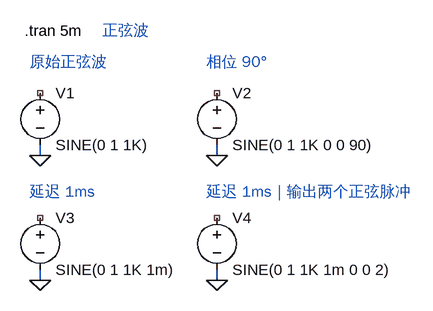
[diagram p0: schematic 03_SINWave.asc]
03_SINWave.asc, the LTspice schematic file:
Version 4
SHEET 1 880 680
WIRE 32 224 32 208
WIRE 304 224 304 208
WIRE 32 416 32 400
WIRE 304 416 304 400
FLAG 32 224 0
FLAG 304 224 0
FLAG 32 416 0
FLAG 304 416 0
SYMBOL Voltage 32 112 R0
SYMATTR InstName V1
SYMATTR Value SINE(0 1 1K)
SYMBOL Voltage 304 112 R0
SYMATTR InstName V2
SYMATTR Value SINE(0 1 1K 0 0 90)
SYMBOL Voltage 32 304 R0
SYMATTR InstName V3
SYMATTR Value SINE(0 1 1K 1m)
SYMBOL Voltage 304 304 R0
SYMATTR InstName V4
SYMATTR Value SINE(0 1 1K 1m 0 0 2)
TEXT 16 80 Left 2 ;原始正弦波
TEXT 8 32 Left 2 !.tran 5m
TEXT 288 80 Left 2 ;相位 90°
TEXT 16 280 Left 2 ;延迟 1ms
TEXT 288 280 Left 2 ;延迟 1ms｜输出两个正弦脉冲
TEXT 128 32 Left 2 ;正弦波

The netlist it stands for:
* 03_SINWave.asc
V1 NC_01 0 SINE(0 1 1K)
V2 NC_02 0 SINE(0 1 1K 0 0 90)
V3 NC_03 0 SINE(0 1 1K 1m)
V4 NC_04 0 SINE(0 1 1K 1m 0 0 2)
* 原始正弦波
.tran 5m
* 相位 90°
* 延迟 1ms
* 延迟 1ms｜输出两个正弦脉冲
* 正弦波
.backanno
.end